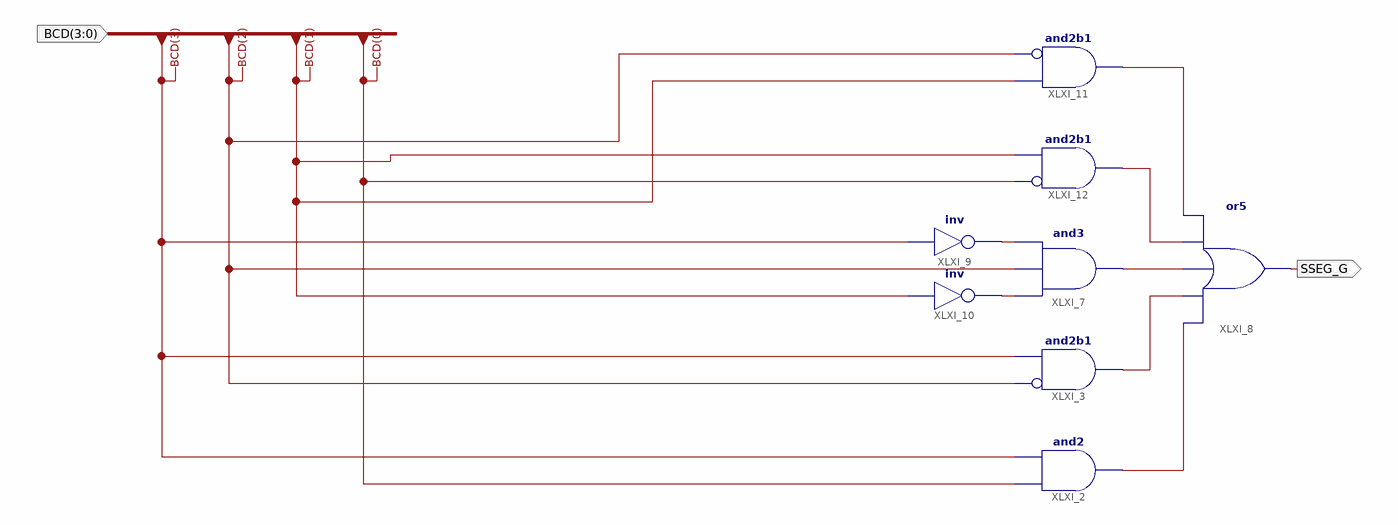
[diagram p0: schematic sheet 1]
// Xilinx ISE schematic SSEG_G.sch (spartan6) as structural Verilog: 8 symbols, 2 ports
module SSEG_G (
  input  [3:0] BCD,
  output SSEG_G
);

  wire XLXN_42, XLXN_43, XLXN_44, XLXN_45, XLXN_46, XLXN_47, XLXN_48;

  and XLXI_2 (XLXN_42, BCD[0], BCD[3]);
  and XLXI_3 (XLXN_43, ~BCD[2], BCD[3]);  // and2b1
  and XLXI_7 (XLXN_44, XLXN_45, BCD[2], XLXN_46);
  or XLXI_8 (SSEG_G, XLXN_48, XLXN_47, XLXN_44, XLXN_43, XLXN_42);
  not XLXI_9 (XLXN_45, BCD[3]);
  not XLXI_10 (XLXN_46, BCD[1]);
  and XLXI_11 (XLXN_48, ~BCD[2], BCD[1]);  // and2b1
  and XLXI_12 (XLXN_47, ~BCD[0], BCD[1]);  // and2b1
endmodule
